# Altium schematic sheet mix_rxd.SchDoc: mcHF Pro Transceiver Mixer board
size A3; Author: Krassi Atanassov; CompanyName: MØNKA; Engineer: For radio amateurs experimentation, non-commercial use only. Thank you!; Revision: 0.8.6; SheetTotal: 6
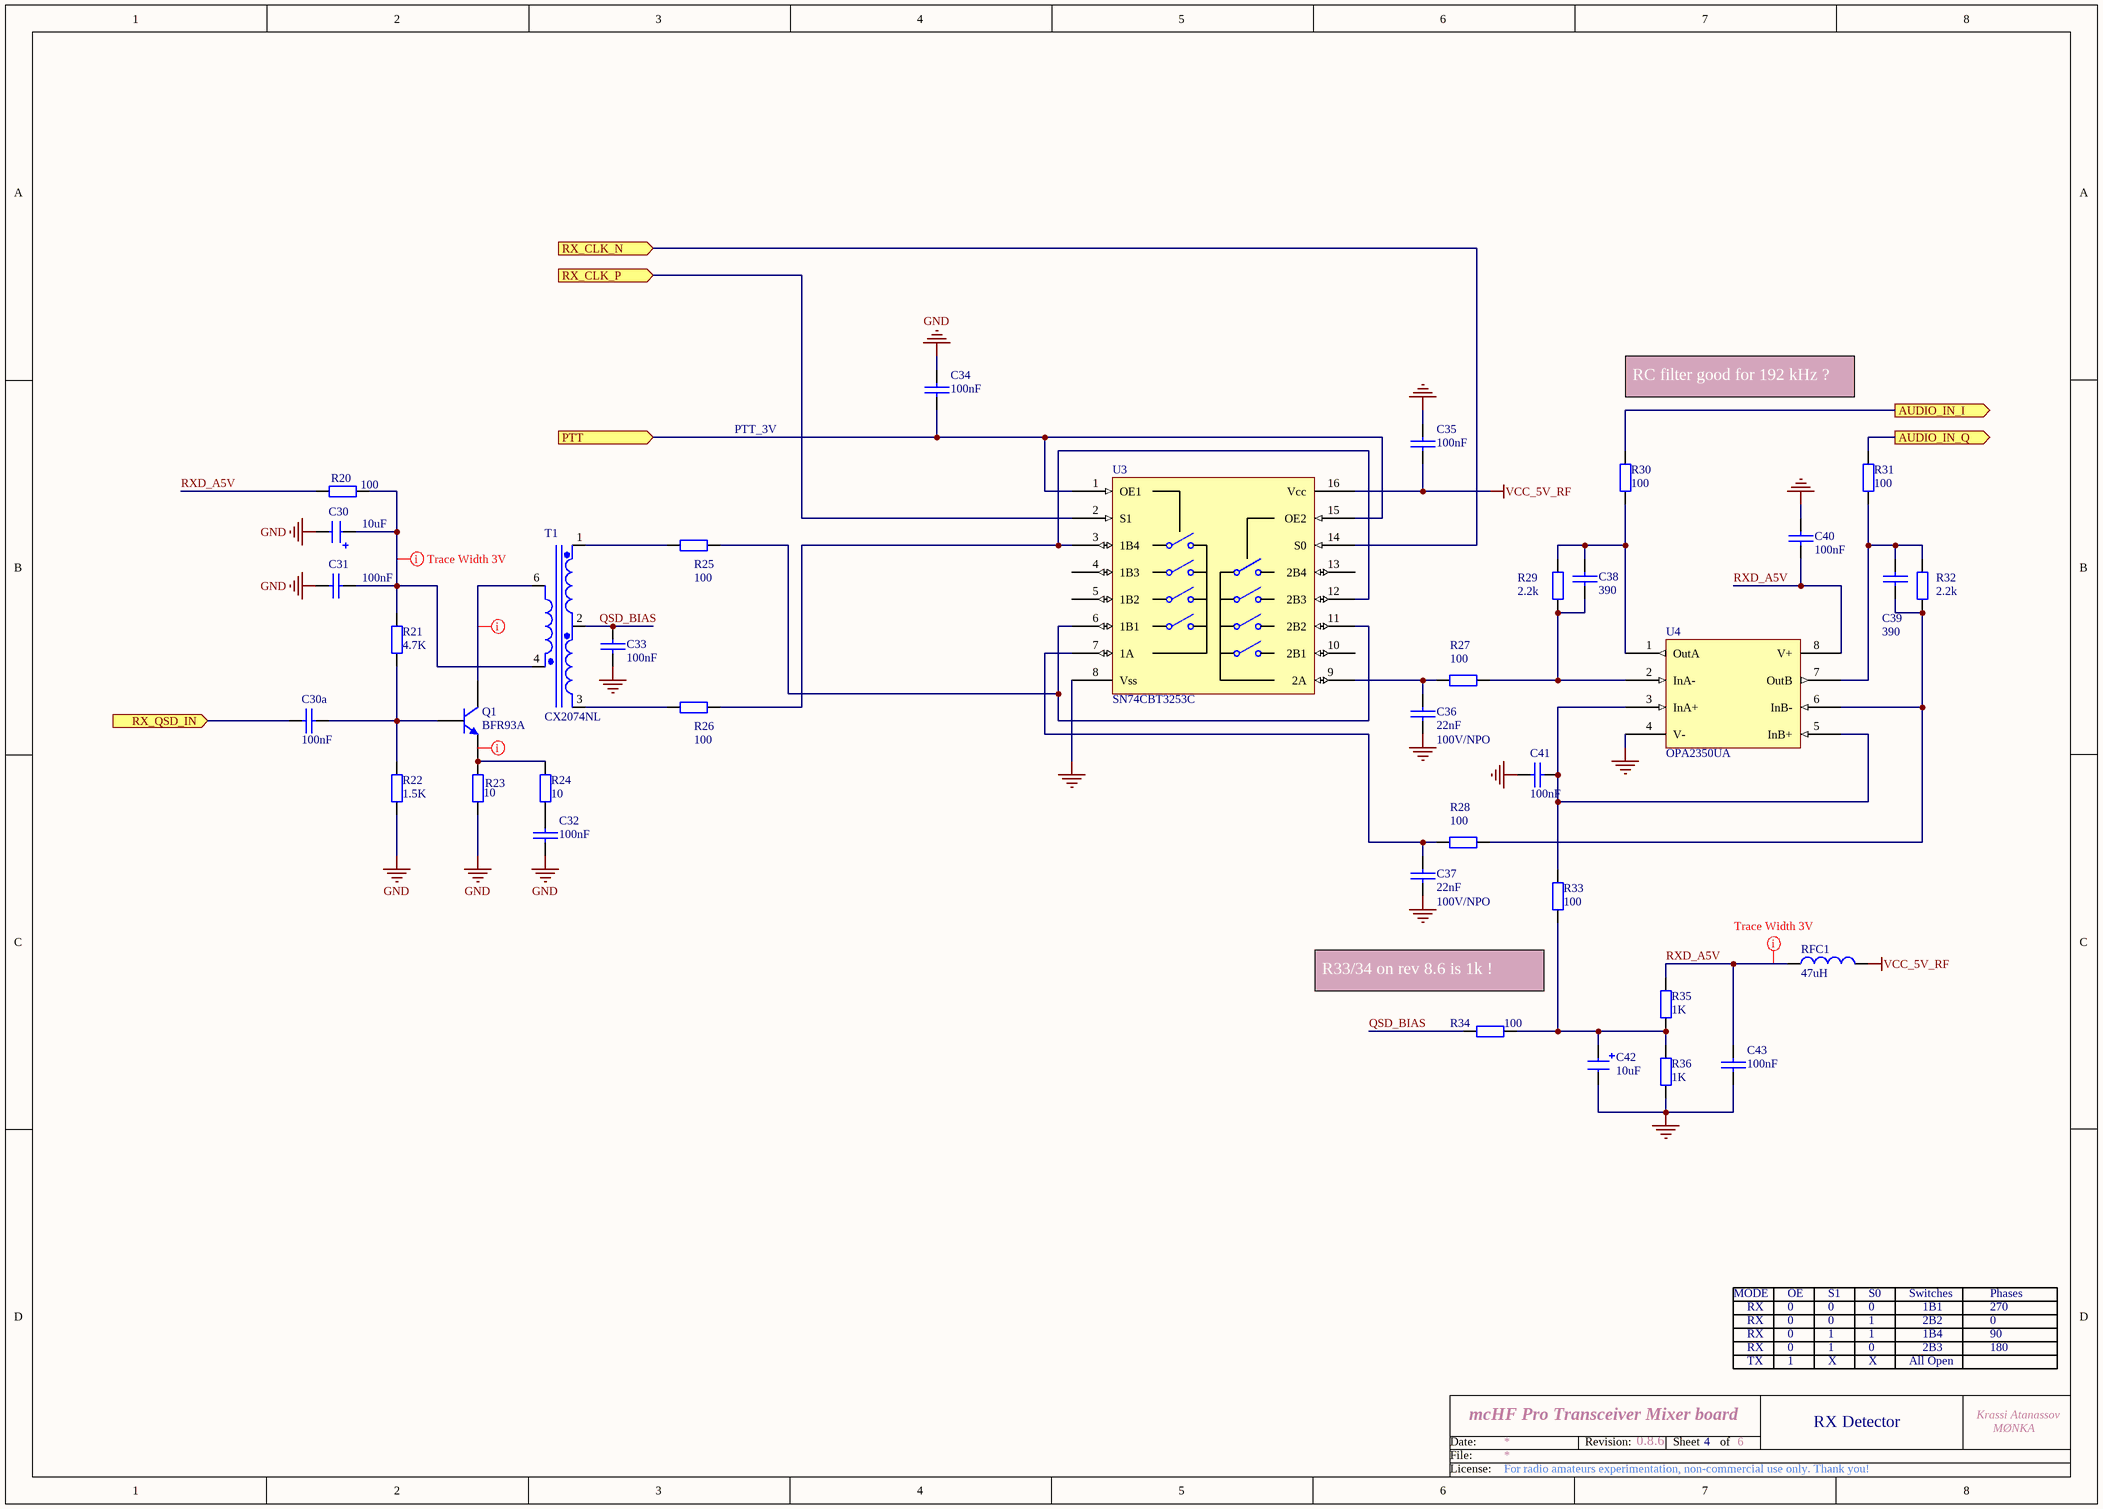
[diagram p0: mix_rxd.SchDoc]

## Parts
C30  10uF  [1206_Elec_Cap]
C30a  100nF  [0805]
C31  100nF  [0805]
C32  100nF  [0805]
C33  100nF  [0805]
C34  100nF  [0805]
C35  100nF  [0805]
C36  22nF  Voltage: 100V/NPO  [CAP_B]
C37  22nF  Voltage: 100V/NPO  [CAP_B]
C38  390  [0805]
C39  390  [0805]
C40  100nF  [0805]
C41  100nF  [0805]
C42  10uF  [1206_Elec_Cap]
C43  100nF  [0805]
Q1  BFR93A  [SOT-23]
R20  100  [0805]
R21  4.7K  [0805]
R22  1.5K  [0805]
R23  10  [0805]
R24  10  [0805]
R25  100  [0805]
R26  100  [0805]
R27  100  [0805]
R28  100  [0805]
R29  2.2k  [0805]
R30  100  [0805]
R31  100  [0805]
R32  2.2k  [0805]
R33  100  [0805]
R34  100  [0805]
R35  1K  [0805]
R36  1K  [0805]
RFC1  47uH  [0805]
T1  CX2074NL  [SOP5_NEW1]
U3  SN74CBT3253C  [SO-16-Pro]
U4  OPA2350UA  [SO-8]

## Ports
AUDIO_IN_I (out), AUDIO_IN_Q (out), PTT (in), RX_CLK_N (in), RX_CLK_P (in), RX_QSD_IN (in)

## Nets
GND: C30.2 C31.2 C32.1 C33.2 C34.2 C35.2 C36.2 C37.2 C40.1 C41.2 C42.2 C43.1 R22.2 R23.1 R36.1 U3.8(Vss) U4.4(V-)
VCC_5V_RF: C35.1 RFC1.2 U3.16(Vcc)
AUDIO_IN_I: R30.2 ; port AUDIO_IN_I
AUDIO_IN_Q: R31.2 ; port AUDIO_IN_Q
PTT: C34.1 U3.1(OE1) U3.15(OE2) ; port PTT
QSD_BIAS: C33.1 R34.2 T1.2(SecCmn)
RX_CLK_N: U3.14(S0) ; port RX_CLK_N
RX_CLK_P: U3.2(S1) ; port RX_CLK_P
RX_QSD_IN: C30a.1 ; port RX_QSD_IN
RXD_A5V: C40.2 C43.2 R20.1 R35.2 RFC1.1 U4.8(V+)
NetC30_1: C30.1 C31.1 R20.2 R21.1 T1.4(Pri-)
NetC30a_2: C30a.2 Q1.1(B) R21.2 R22.1
NetC32_2: C32.2 R24.1
NetC36_1: C36.1 R27.1 U3.9(2A)
NetC37_1: C37.1 R28.1 U3.7(1A)
NetC38_1: C38.1 R27.2 R29.1 U4.2(InA-)
NetC38_2: C38.2 R29.2 R30.1 U4.1(OutA)
NetC39_1: C39.1 R28.2 R32.1 U4.6(InB-)
NetC39_2: C39.2 R31.1 R32.2 U4.7(OutB)
NetC41_1: C41.1 R33.2 U4.3(InA+) U4.5(InB+)
NetC42_1: C42.1 R33.1 R34.1 R35.1 R36.2
NetQ1_2: Q1.2(E) R23.2 R24.2
NetQ1_3: Q1.3(C) T1.6(Pri+)
NetR25_1: R25.1 T1.1(Sec0)
NetR25_2: R25.2 U3.6(1B1) U3.11(2B2)
NetR26_1: R26.1 T1.3(Sec180)
NetR26_2: R26.2 U3.3(1B4) U3.12(2B3)

Not connected (* = marked no-connect by the designer): U3 4(1B3) 5(1B2) 10(2B1) 13(2B4)

## Layout directives
rule Width Constraint [Pref Width = 12mil    Min Width = 12mil    Max Width = 12mil]: (no net found under the mark), NetC30_1, NetQ1_3, RXD_A5V

## Notes on the sheet
- PTT_3V
- RC filter good for 192 kHz ?
- R33/34 on rev 8.6 is 1k !
- MODE
- RX
- 0
- OE
- S1
- S0
- 1
- Switches
- 1B1
- 2B2
- Phases
- 270
- TX
- X
- All Open
- 2B3
- 1B4
- 180
- 90
- 4
- RX Detector
- Date:
- File:
- Revision:
- Sheet
- of
- License:

## Library data of the parts
C30 C42 = CAP-POL: Electrolitic capacitor; Order: FN 233-3009; QT Order: QCC-00166; Price: 0.204
C30a C31-C35 C40 C41 C43 = CAP: Capacitor; Order: FN 252-2090; QT Order: QCC-00154; Price: 0.068
C36 C37 = CAP: Capacitor; Order: FN 221-1120; Price: 0.84
C38 C39 = CAP: Capacitor; Order: FN 233-2701; QT Order: QCC-00125; Price: 0.078
Q1 = BFR93A: TRANSISTOR, RF, NPN, 12V, 0.035MA,SOT-23; Order: FN 108-1300; Price: 0.161
R20 R25-R28 R30 R31 R33 R34 = RES: Resistor; Order: FN 933-2375; QT Order: QCR-00301; Price: 0.027
R21 = RES: Resistor; Order: FN 200-8383; QT Order: QCR-00341; Price: 0.024
R22 = RES: Resistor; Order: FN 165-2940; QT Order: QCR-00329; Price: 0.036
R23 R24 = RES: Resistor; Order: FN 933-2421; QT Order: QCR-00279; Price: 0.013
R29 R32 = RES: Resistor; Order: FN 188-7289; QT Order: QCR-00333; Price: 0.046
R35 R36 = RES: Resistor; Order: FN 157-6459; QT Order: QCR-00579; Price: 0.061
RFC1 = TDK-NLV25T: INDUCTOR, SIGNAL LINE, 4.7UH, 1005; Order: FN 166-9895; Price: 0.166
T1 = CX2074NL: Wideband RF Transformer 1:4; Order: DK 553-1655-ND; Price: 2.01
U3 = SN74CBT3253C: Dual 4:1 Demux/Analog Switch; Order: FN 175-0447; Price: 0.69
U4 = OPA2350UA: High Speed, Single Supply OpAmp; Order: FN 110-1542; Price: 4.67